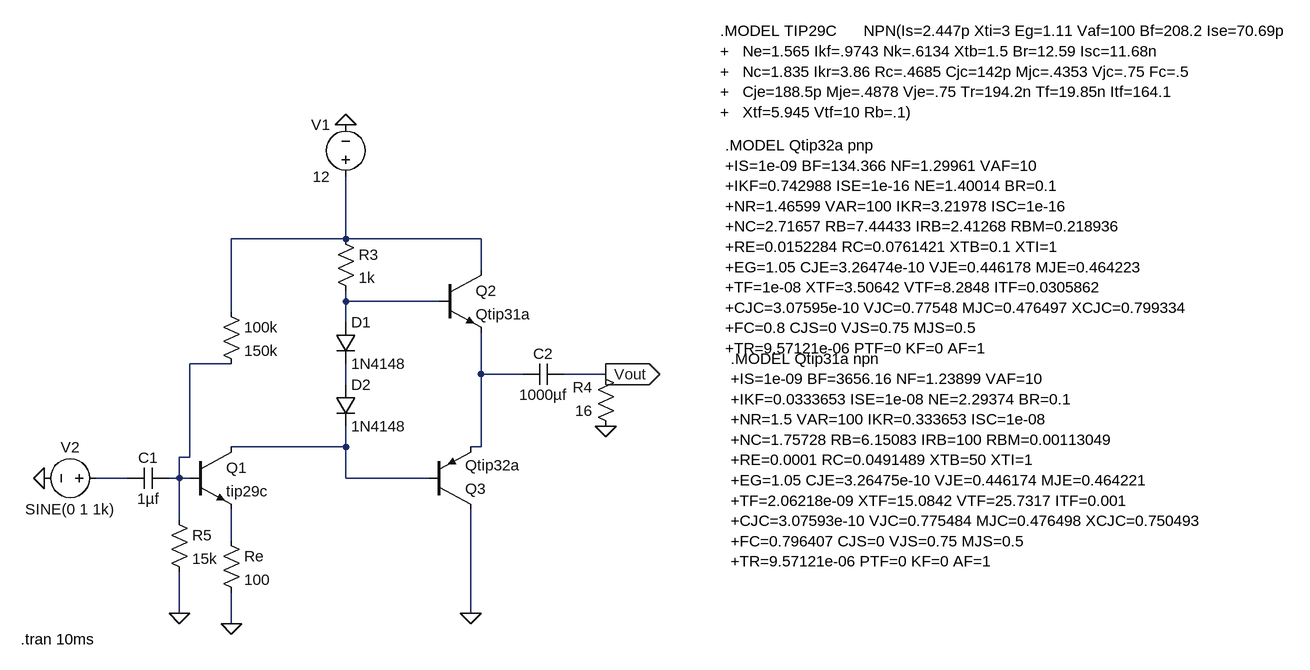
[diagram p0: schematic Power Amplifier.asc]
Power Amplifier.asc, the LTspice schematic file:
Version 4
SHEET 1 1832 732
WIRE 304 -128 304 -224
WIRE 304 -128 128 -128
WIRE 512 -128 304 -128
WIRE 512 -80 512 -128
WIRE 304 -32 304 -48
WIRE 448 -32 304 -32
WIRE 128 -16 128 -128
WIRE 304 0 304 -32
WIRE 128 64 64 64
WIRE 512 80 512 16
WIRE 576 80 512 80
WIRE 704 80 640 80
WIRE 304 96 304 64
WIRE 304 192 304 160
WIRE 304 192 128 192
WIRE 512 192 512 80
WIRE 512 192 496 192
WIRE 64 208 64 64
WIRE 64 208 48 208
WIRE -32 240 -80 240
WIRE 48 240 48 208
WIRE 48 240 32 240
WIRE 64 240 48 240
WIRE 304 240 304 192
WIRE 432 240 304 240
WIRE 48 304 48 240
WIRE 128 336 128 288
WIRE 48 448 48 384
WIRE 496 448 496 288
WIRE 128 464 128 416
FLAG 128 464 0
FLAG 704 160 0
FLAG 496 448 0
FLAG 304 -304 0
FLAG 704 80 Vout
IOPIN 704 80 Out
FLAG -160 240 0
FLAG 48 448 0
SYMBOL cap 32 224 R90
WINDOW 0 0 32 VBottom 2
WINDOW 3 32 32 VTop 2
SYMATTR InstName C1
SYMATTR Value 1µf
SYMBOL res 112 320 R0
SYMATTR InstName Re
SYMATTR Value 100
SYMBOL res 288 -144 R0
SYMATTR InstName R3
SYMATTR Value 1k
SYMBOL npn 64 192 R0
SYMATTR InstName Q1
SYMATTR Value tip29c
SYMBOL npn 448 -80 R0
SYMATTR InstName Q2
SYMATTR Value Qtip31a
SYMBOL diode 288 0 R0
SYMATTR InstName D1
SYMATTR Value 1N4148
SYMBOL diode 288 96 R0
SYMATTR InstName D2
SYMATTR Value 1N4148
SYMBOL cap 576 64 M90
WINDOW 0 0 32 VBottom 2
WINDOW 3 32 32 VTop 2
SYMATTR InstName C2
SYMATTR Value 1000µf
SYMBOL res 720 176 R180
WINDOW 0 36 76 Left 2
WINDOW 3 36 40 Left 2
SYMATTR InstName R4
SYMATTR Value 16
SYMBOL voltage 304 -208 R180
WINDOW 0 24 96 Left 2
WINDOW 3 24 16 Left 2
WINDOW 123 0 0 Left 0
WINDOW 39 0 0 Left 0
SYMATTR InstName V1
SYMATTR Value 12
SYMBOL voltage -64 240 R90
WINDOW 0 -32 56 VBottom 2
WINDOW 3 32 56 VTop 2
WINDOW 123 0 0 Left 0
WINDOW 39 0 0 Left 0
SYMATTR InstName V2
SYMATTR Value SINE(0 1 1k)
SYMBOL res 32 288 R0
SYMATTR InstName R5
SYMATTR Value 15k
SYMBOL res 112 -32 R0
SYMATTR InstName 100k
SYMATTR Value 150k
SYMBOL pnp 432 288 M180
SYMATTR InstName Q3
SYMATTR Value Qtip32a
TEXT 888 -272 Left 2 !.MODEL Qtip32a pnp\n+IS=1e-09 BF=134.366 NF=1.29961 VAF=10\n+IKF=0.742988 ISE=1e-16 NE=1.40014 BR=0.1\n+NR=1.46599 VAR=100 IKR=3.21978 ISC=1e-16\n+NC=2.71657 RB=7.44433 IRB=2.41268 RBM=0.218936\n+RE=0.0152284 RC=0.0761421 XTB=0.1 XTI=1\n+EG=1.05 CJE=3.26474e-10 VJE=0.446178 MJE=0.464223\n+TF=1e-08 XTF=3.50642 VTF=8.2848 ITF=0.0305862\n+CJC=3.07595e-10 VJC=0.77548 MJC=0.476497 XCJC=0.799334\n+FC=0.8 CJS=0 VJS=0.75 MJS=0.5\n+TR=9.57121e-06 PTF=0 KF=0 AF=1
TEXT 896 56 Left 2 !.MODEL Qtip31a npn\n+IS=1e-09 BF=3656.16 NF=1.23899 VAF=10\n+IKF=0.0333653 ISE=1e-08 NE=2.29374 BR=0.1\n+NR=1.5 VAR=100 IKR=0.333653 ISC=1e-08\n+NC=1.75728 RB=6.15083 IRB=100 RBM=0.00113049\n+RE=0.0001 RC=0.0491489 XTB=50 XTI=1\n+EG=1.05 CJE=3.26475e-10 VJE=0.446174 MJE=0.464221\n+TF=2.06218e-09 XTF=15.0842 VTF=25.7317 ITF=0.001\n+CJC=3.07593e-10 VJC=0.775484 MJC=0.476498 XCJC=0.750493\n+FC=0.796407 CJS=0 VJS=0.75 MJS=0.5\n+TR=9.57121e-06 PTF=0 KF=0 AF=1
TEXT 880 -448 Left 2 !.MODEL TIP29C      NPN(Is=2.447p Xti=3 Eg=1.11 Vaf=100 Bf=208.2 Ise=70.69p\n+   Ne=1.565 Ikf=.9743 Nk=.6134 Xtb=1.5 Br=12.59 Isc=11.68n\n+   Nc=1.835 Ikr=3.86 Rc=.4685 Cjc=142p Mjc=.4353 Vjc=.75 Fc=.5\n+   Cje=188.5p Mje=.4878 Vje=.75 Tr=194.2n Tf=19.85n Itf=164.1\n+   Xtf=5.945 Vtf=10 Rb=.1)
TEXT -196 488 Left 2 !.tran 10ms

The netlist it stands for:
* Power Amplifier.asc
C1 N003 N007 1µf
Re N008 0 100
R3 N001 N002 1k
Q1 N006 N003 N008 0 tip29c
Q2 N001 N002 N004 0 Qtip31a
D1 N002 N005 1N4148
D2 N005 N006 1N4148
C2 N004 Vout 1000µf
R4 0 Vout 16
V1 N001 0 12
V2 N007 0 SINE(0 1 1k)
R5 N003 0 15k
R§100k N001 N003 150k
Q3 0 N006 N004 0 Qtip32a
.model D D
.lib standard.dio
.model NPN NPN
.model PNP PNP
.lib standard.bjt
.MODEL Qtip32a pnp
+IS=1e-09 BF=134.366 NF=1.29961 VAF=10
+IKF=0.742988 ISE=1e-16 NE=1.40014 BR=0.1
+NR=1.46599 VAR=100 IKR=3.21978 ISC=1e-16
+NC=2.71657 RB=7.44433 IRB=2.41268 RBM=0.218936
+RE=0.0152284 RC=0.0761421 XTB=0.1 XTI=1
+EG=1.05 CJE=3.26474e-10 VJE=0.446178 MJE=0.464223
+TF=1e-08 XTF=3.50642 VTF=8.2848 ITF=0.0305862
+CJC=3.07595e-10 VJC=0.77548 MJC=0.476497 XCJC=0.799334
+FC=0.8 CJS=0 VJS=0.75 MJS=0.5
+TR=9.57121e-06 PTF=0 KF=0 AF=1
.MODEL Qtip31a npn
+IS=1e-09 BF=3656.16 NF=1.23899 VAF=10
+IKF=0.0333653 ISE=1e-08 NE=2.29374 BR=0.1
+NR=1.5 VAR=100 IKR=0.333653 ISC=1e-08
+NC=1.75728 RB=6.15083 IRB=100 RBM=0.00113049
+RE=0.0001 RC=0.0491489 XTB=50 XTI=1
+EG=1.05 CJE=3.26475e-10 VJE=0.446174 MJE=0.464221
+TF=2.06218e-09 XTF=15.0842 VTF=25.7317 ITF=0.001
+CJC=3.07593e-10 VJC=0.775484 MJC=0.476498 XCJC=0.750493
+FC=0.796407 CJS=0 VJS=0.75 MJS=0.5
+TR=9.57121e-06 PTF=0 KF=0 AF=1
.MODEL TIP29C      NPN(Is=2.447p Xti=3 Eg=1.11 Vaf=100 Bf=208.2 Ise=70.69p
+   Ne=1.565 Ikf=.9743 Nk=.6134 Xtb=1.5 Br=12.59 Isc=11.68n
+   Nc=1.835 Ikr=3.86 Rc=.4685 Cjc=142p Mjc=.4353 Vjc=.75 Fc=.5
+   Cje=188.5p Mje=.4878 Vje=.75 Tr=194.2n Tf=19.85n Itf=164.1
+   Xtf=5.945 Vtf=10 Rb=.1)
.tran 10ms
.backanno
.end